# EAGLE design LEDBoard (EAGLE 7.6.0)
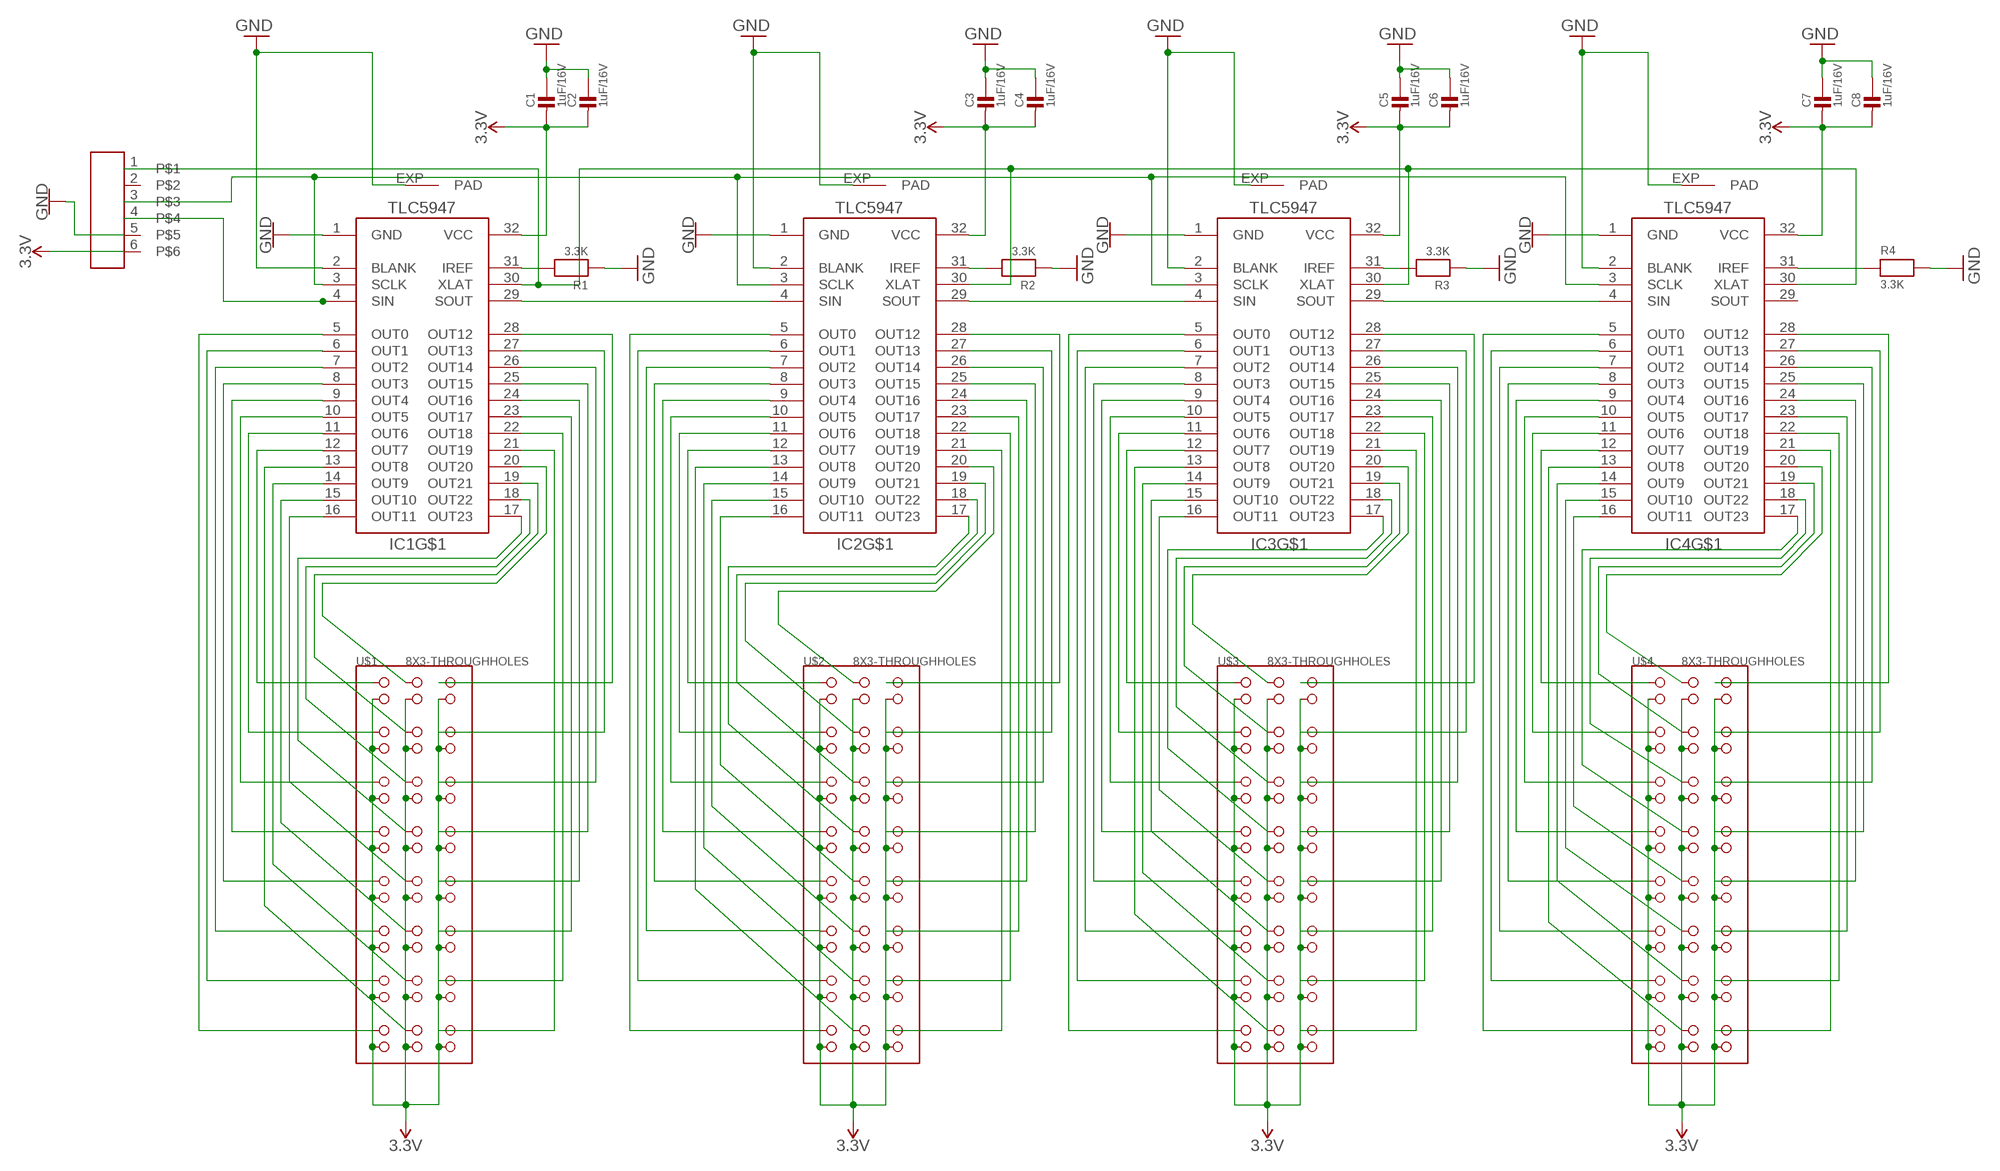
[diagram p0: schematic, sheet 1]

## Parts
C1  1uF/16V  CAP_CERAMIC_0805  [_0805]
C2  1uF/16V  CAP_CERAMIC_0805  [_0805]
C3  1uF/16V  CAP_CERAMIC_0805  [_0805]
C4  1uF/16V  CAP_CERAMIC_0805  [_0805]
C5  1uF/16V  CAP_CERAMIC_0805  [_0805]
C6  1uF/16V  CAP_CERAMIC_0805  [_0805]
C7  1uF/16V  CAP_CERAMIC_0805  [_0805]
C8  1uF/16V  CAP_CERAMIC_0805  [_0805]
IC1  TLC5947-DAP  [HTSSOP32DAP]
IC2  TLC5947-DAP  [HTSSOP32DAP]
IC3  TLC5947-DAP  [HTSSOP32DAP]
IC4  TLC5947-DAP  [HTSSOP32DAP]
R1  3.3K  RESISTOR_0805  [_0805]
R2  3.3K  RESISTOR_0805  [_0805]
R3  3.3K  RESISTOR_0805  [_0805]
R4  3.3K  RESISTOR_0805  [_0805]
U$1  8X3-THROUGHHOLES  [COLUMNOFTHROUGHHOLES]
U$2  8X3-THROUGHHOLES  [COLUMNOFTHROUGHHOLES]
U$3  8X3-THROUGHHOLES  [COLUMNOFTHROUGHHOLES]
U$4  8X3-THROUGHHOLES  [COLUMNOFTHROUGHHOLES]
U$5  CONNECTOR_6PIN  [CONNECTOR_6PIN]

## Nets
0: IC1.5(OUT0) U$1.0
1: IC1.6(OUT1) U$1.1
2: IC1.7(OUT2) U$1.2
3: IC1.8(OUT3) U$1.3
3.3V: C1.2 C2.2 C3.2 C4.2 C5.2 C6.2 C7.2 C8.2 IC1.32(VCC) IC2.32(VCC) IC3.32(VCC) IC4.32(VCC) U$1.V0(V) U$1.V1(V) U$1.V2(V) U$1.V3(V) U$1.V4(V) U$1.V5(V) U$1.V6(V) U$1.V7(V) U$1.V8(V) U$1.V9(V) U$1.V10(V) U$1.V11(V) U$1.V12(V) U$1.V13(V) U$1.V14(V) U$1.V15(V) U$1.V16(V) U$1.V17(V) U$1.V18(V) U$1.V19(V) U$1.V20(V) U$1.V21(V) U$1.V22(V) U$1.V23(V) U$2.V0(V) U$2.V1(V) U$2.V2(V) U$2.V3(V) U$2.V4(V) U$2.V5(V) U$2.V6(V) U$2.V7(V) U$2.V8(V) U$2.V9(V) U$2.V10(V) U$2.V11(V) U$2.V12(V) U$2.V13(V) U$2.V14(V) U$2.V15(V) U$2.V16(V) U$2.V17(V) U$2.V18(V) U$2.V19(V) U$2.V20(V) U$2.V21(V) U$2.V22(V) U$2.V23(V) U$3.V0(V) U$3.V1(V) U$3.V2(V) U$3.V3(V) U$3.V4(V) U$3.V5(V) U$3.V6(V) U$3.V7(V) U$3.V8(V) U$3.V9(V) U$3.V10(V) U$3.V11(V) U$3.V12(V) U$3.V13(V) U$3.V14(V) U$3.V15(V) U$3.V16(V) U$3.V17(V) U$3.V18(V) U$3.V19(V) U$3.V20(V) U$3.V21(V) U$3.V22(V) U$3.V23(V) U$4.V0(V) U$4.V1(V) U$4.V2(V) U$4.V3(V) U$4.V4(V) U$4.V5(V) U$4.V6(V) U$4.V7(V) U$4.V8(V) U$4.V9(V) U$4.V10(V) U$4.V11(V) U$4.V12(V) U$4.V13(V) U$4.V14(V) U$4.V15(V) U$4.V16(V) U$4.V17(V) U$4.V18(V) U$4.V19(V) U$4.V20(V) U$4.V21(V) U$4.V22(V) U$4.V23(V) U$5.6
4: IC1.9(OUT4) U$1.4
5: IC1.10(OUT5) U$1.5
6: IC1.11(OUT6) U$1.6
7: IC1.12(OUT7) U$1.7
8: IC1.13(OUT8) U$1.8
9: IC1.14(OUT9) U$1.9
10: IC1.15(OUT10) U$1.10
11: IC1.16(OUT11) U$1.11
12: IC1.17(OUT23) U$1.12
13: IC1.18(OUT22) U$1.13
14: IC1.19(OUT21) U$1.14
15: IC1.20(OUT20) U$1.15
16: IC1.21(OUT19) U$1.16
17: IC1.22(OUT18) U$1.17
18: IC1.23(OUT17) U$1.18
19: IC1.24(OUT16) U$1.19
20: IC1.25(OUT15) U$1.20
21: IC1.26(OUT14) U$1.21
22: IC1.27(OUT13) U$1.22
23: IC1.28(OUT12) U$1.23
24: IC2.5(OUT0) U$2.0
25: IC2.6(OUT1) U$2.1
26: IC2.7(OUT2) U$2.2
27: IC2.8(OUT3) U$2.3
28: IC2.9(OUT4) U$2.4
29: IC2.10(OUT5) U$2.5
30: IC2.11(OUT6) U$2.6
31: IC2.12(OUT7) U$2.7
32: IC2.13(OUT8) U$2.8
33: IC2.14(OUT9) U$2.9
34: IC2.15(OUT10) U$2.10
35: IC2.16(OUT11) U$2.11
36: IC2.17(OUT23) U$2.12
37: IC2.18(OUT22) U$2.13
38: IC2.19(OUT21) U$2.14
39: IC2.20(OUT20) U$2.15
40: IC2.21(OUT19) U$2.16
41: IC2.22(OUT18) U$2.17
42: IC2.23(OUT17) U$2.18
43: IC2.24(OUT16) U$2.19
44: IC2.25(OUT15) U$2.20
45: IC2.26(OUT14) U$2.21
46: IC2.27(OUT13) U$2.22
47: IC2.28(OUT12) U$2.23
48: IC3.5(OUT0) U$3.0
49: IC3.6(OUT1) U$3.1
50: IC3.7(OUT2) U$3.2
51: IC3.8(OUT3) U$3.3
52: IC3.9(OUT4) U$3.4
53: IC3.10(OUT5) U$3.5
54: IC3.11(OUT6) U$3.6
55: IC3.12(OUT7) U$3.7
56: IC3.13(OUT8) U$3.8
57: IC3.14(OUT9) U$3.9
58: IC3.15(OUT10) U$3.10
59: IC3.16(OUT11) U$3.11
60: IC3.17(OUT23) U$3.12
61: IC3.18(OUT22) U$3.13
62: IC3.19(OUT21) U$3.14
63: IC3.20(OUT20) U$3.15
64: IC3.21(OUT19) U$3.16
65: IC3.22(OUT18) U$3.17
66: IC3.23(OUT17) U$3.18
67: IC3.24(OUT16) U$3.19
68: IC3.25(OUT15) U$3.20
69: IC3.26(OUT14) U$3.21
70: IC3.27(OUT13) U$3.22
71: IC3.28(OUT12) U$3.23
72: IC4.5(OUT0) U$4.0
73: IC4.6(OUT1) U$4.1
74: IC4.7(OUT2) U$4.2
75: IC4.8(OUT3) U$4.3
76: IC4.9(OUT4) U$4.4
77: IC4.10(OUT5) U$4.5
78: IC4.11(OUT6) U$4.6
79: IC4.12(OUT7) U$4.7
80: IC4.13(OUT8) U$4.8
81: IC4.14(OUT9) U$4.9
82: IC4.15(OUT10) U$4.10
83: IC4.16(OUT11) U$4.11
84: IC4.17(OUT23) U$4.12
85: IC4.18(OUT22) U$4.13
86: IC4.19(OUT21) U$4.14
87: IC4.20(OUT20) U$4.15
88: IC4.21(OUT19) U$4.16
89: IC4.22(OUT18) U$4.17
90: IC4.23(OUT17) U$4.18
91: IC4.24(OUT16) U$4.19
92: IC4.25(OUT15) U$4.20
93: IC4.26(OUT14) U$4.21
94: IC4.27(OUT13) U$4.22
95: IC4.28(OUT12) U$4.23
CLK: IC1.3(SCLK) IC2.3(SCLK) IC3.3(SCLK) IC4.3(SCLK) U$5.3
DATA12: IC1.29(SOUT) IC2.4(SIN)
DATA23: IC2.29(SOUT) IC3.4(SIN)
DATA34: IC3.29(SOUT) IC4.4(SIN)
DATAIN: IC1.4(SIN) U$5.4
GND: C1.1 C2.1 C3.1 C4.1 C5.1 C6.1 C7.1 C8.1 IC1.1(GND) IC1.2(BLANK) IC1.EXP(PAD) IC2.1(GND) IC2.2(BLANK) IC2.EXP(PAD) IC3.1(GND) IC3.2(BLANK) IC3.EXP(PAD) IC4.1(GND) IC4.2(BLANK) IC4.EXP(PAD) R1.1 R2.1 R3.1 R4.2 U$5.5
IREF1: IC1.31(IREF) R1.2
IREF2: IC2.31(IREF) R2.2
IREF3: IC3.31(IREF) R3.2
IREF4: IC4.31(IREF) R4.1
XLAT: IC1.30(XLAT) IC2.30(XLAT) IC3.30(XLAT) IC4.30(XLAT) U$5.1
Unconnected: IC4.29(SOUT) U$5.2

## Library data of the parts
C1-C8 = Adafruit TLC5947:CAP_CERAMIC: Ceramic Capacitors For new designs, use the packages preceded by an '_' character since they are more reliable: The following footprints should be used on most boards: _0402 - Standard footprint for regular board layouts _0603 - Standard footprint for regular board layouts _0805 - Standard footprint for regular board layouts For extremely tight-pitch boards where space is at a premium, the following 'micro-pitch' footprints can be used (smaller pads, no silkscreen outline, etc.): _0402MP - Micro-pitch footprint for very dense/compact boards _0603MP - Micro-pitch footprint for very dense/compact boards _0805MP - Micro-pitch footprint for very dense/compact boards Commonly Stocked Parts 0402 - 0402 Surface Mount Capacitors 16pF 50V 5% [Digikey: 445-4899-2-ND] 18pF 50V 5% [Digikey: 490-1281-2-ND] 22pF 50V 5% [Digikey: 490-1283-2-ND] 68pF 50V 5% [Digikey: 490-1289-2-ND] 0.1uF 10V 10% [Digikey: 490-1318-2-ND] 1.0uF 6.3V 10% [Digikey: 490-1320-2-ND] 0603 - 0603 Surface Mount Capacitors 16 pF 50V 5% [Digikey: 445-5051-2-ND] 22 pF 50V [Digikey: PCC220ACVTR-ND] 33 pF 50V 5% [Digikey: 490-1415-1-ND] 56pF 50V 5% [Digikey: 490-1421-1-ND] 220pF 50V 5% [Digikey: 445-1285-1-ND] 680 pF 50V 2200 pF 50V 5% C0G [Digikey: 445-1297-1-ND] 5600 pF 100V 5% X7R [Digikey: 478-3711-1-ND] 0.1 µF 25V 10% [Digikey: PCC2277TR-ND] 0.22 µF 16V 10% X7R [Digikey: 445-1318-1-ND] 1.0 µF 25V 10% [Digikey: 445-5146-2-ND] 0603 - RF Specific 3pF 250V +/-0.1pF RF [Digikey: 712-1347-1-ND] 18 pF 250V 5% [Digikey: 478-3505-1-ND or 712-1322-1-ND] 56 pF 250V 5% C0G RF [Digikey: 490-4867-1-ND] 68 pF 250V RF [Digikey: 490-4868-1-ND] 0805 - 0805 Surface Mount Capacitors 220 pF 250V 2% RF Ceramic Capacitor [Digikey: 712-1398-1-ND] 1000 pF 50V 2% NP0 Ceramic Capacitor [Digikey: 478-3760-1-ND] 0.1 µF 25V 10% Ceramic Capacitor [Digikey: PCC1828TR-ND] 1.0 µF 16V 10% Ceramic Capacitor[Digikey: 490-1691-2-ND] 10.0 µF 10V 10% Ceramic Capacitor[Digikey: 709-1228-1-ND] 10.0 uF 16V 10% Ceramic Capacitor [Digikey: 478-5165-2-ND] 47 uF 6.3V 20% Ceramic Capacitor [Digikey: 587-1779-1-ND or 399-5506-1-ND] 1206 - 1206 Surface Mount Capacitors 47uF 10V 20% Ceramic Capacitor [Digikey: 490-5528-1-ND or 399-5508-1-ND or 445-6010-1-ND] 100uF 6.3V -20%, +80% Y5V Ceramic Capacitor (Digikey: 490-4512-1-ND, Mouser: 81-GRM31CF50J107ZE1L)
IC1-IC4 = Adafruit TLC5947:TLC5947
R1-R4 = Adafruit TLC5947:RESISTOR: Resistors For new designs, use the packages preceded by an '_' character since they are more reliable: The following footprints should be used on most boards: _0402 - Standard footprint for regular board layouts _0603 - Standard footprint for regular board layouts _0805 - Standard footprint for regular board layouts For extremely tight-pitch boards where space is at a premium, the following 'micro-pitch' footprints can be used (smaller pads, no silkscreen outline, etc.): _0402MP - Micro-pitch footprint for very dense/compact boards _0603MP - Micro-pitch footprint for very dense/compact boards _0805MP - Micro-pitch footprint for very dense/compact boards
U$1-U$4 = Adafruit TLC5947:8X3-THROUGHHOLES
U$5 = TIcustom:CONNECTOR_6PIN

## Board
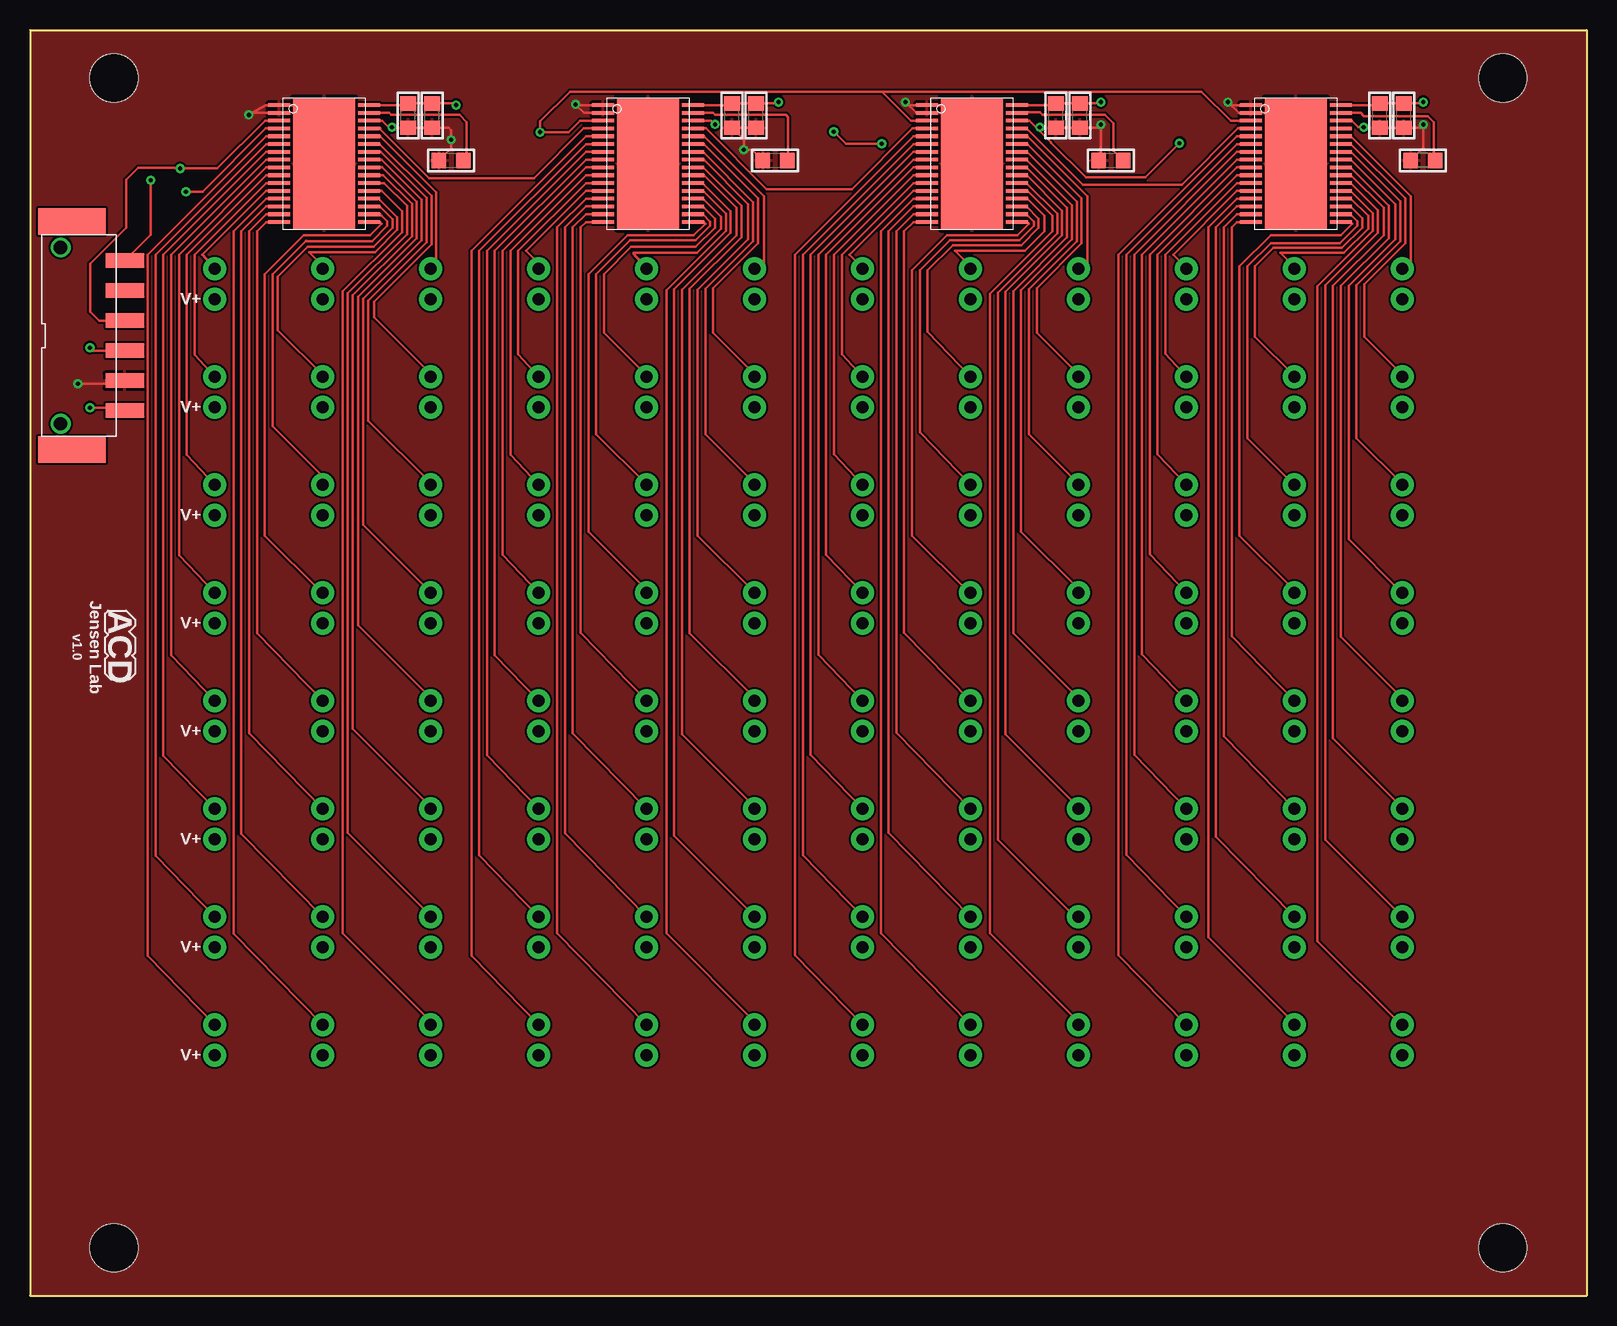
[diagram p1: board, top side]
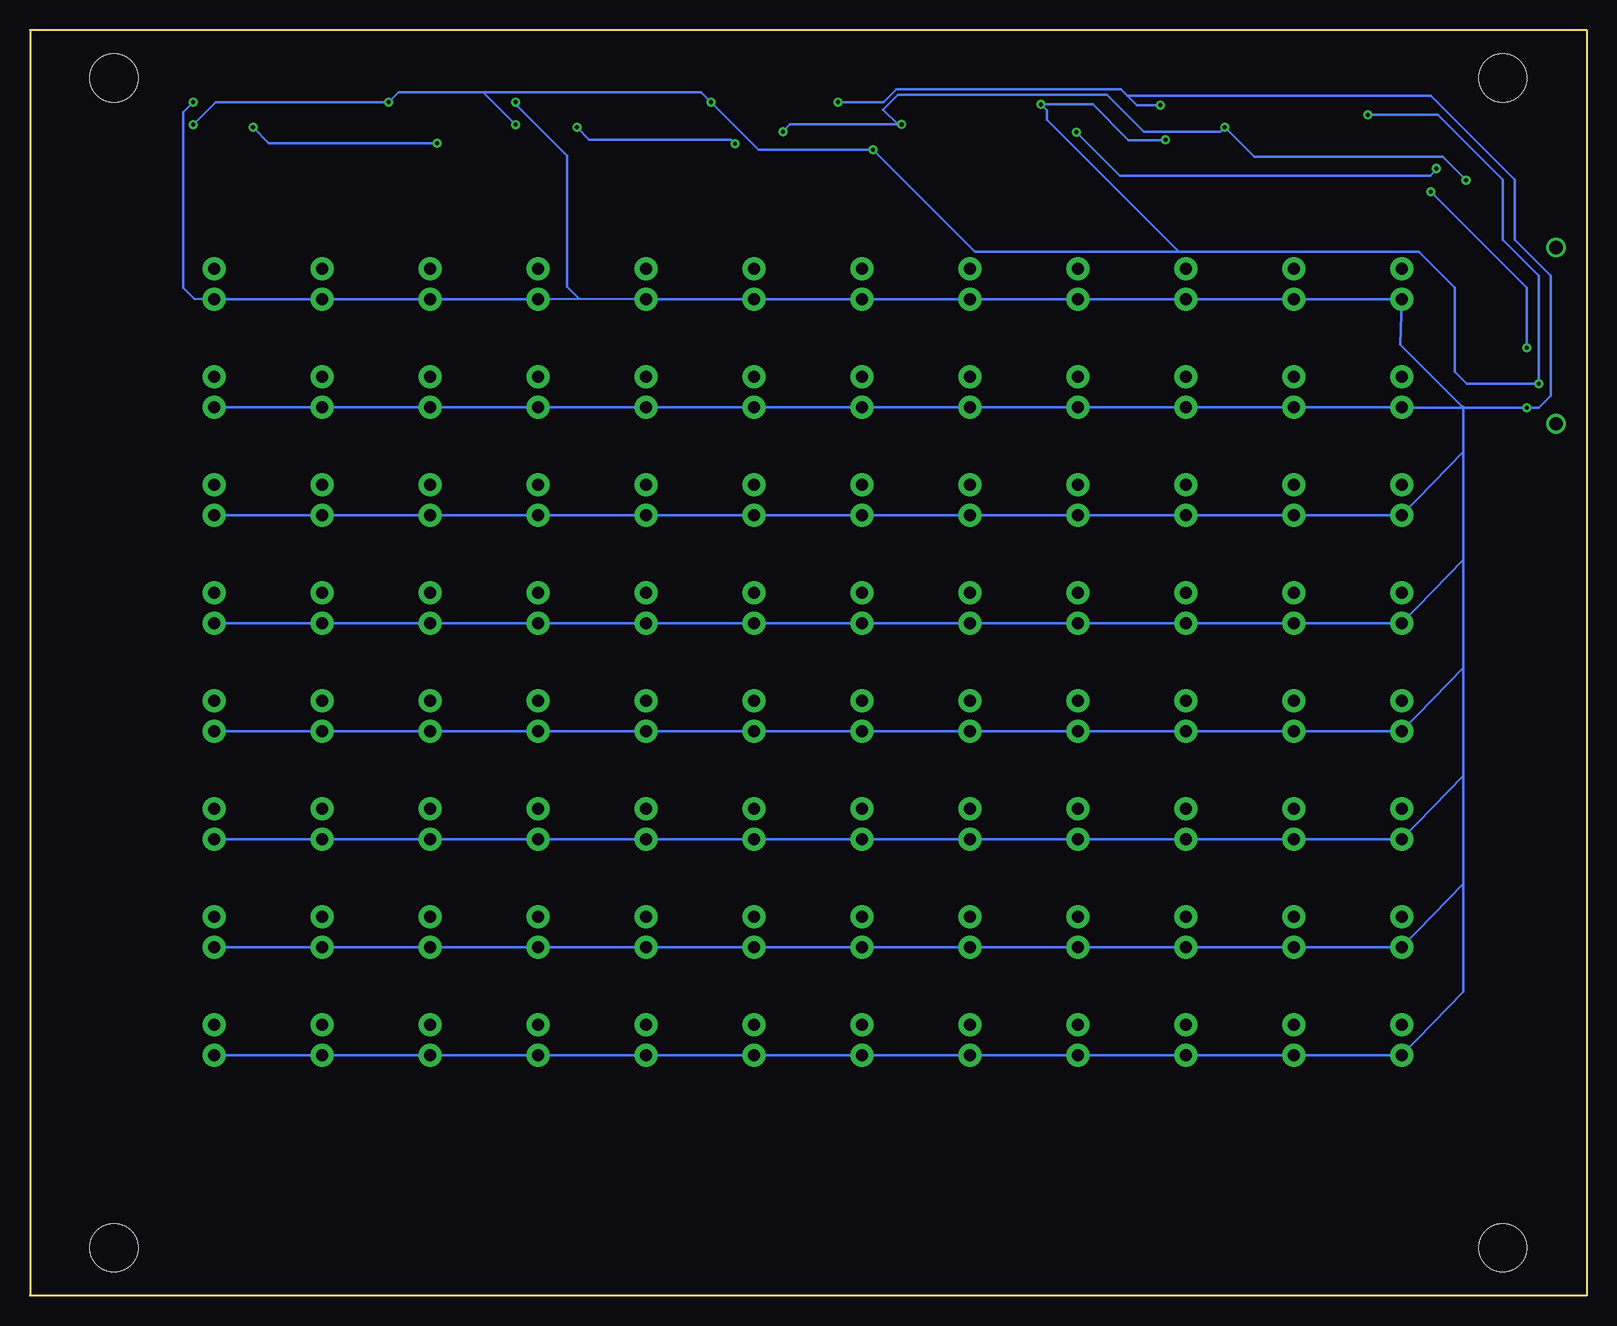
[diagram p2: board, bottom side, seen from below]

Size 129.76 x 105.47 mm. Coordinates in mm from the lower left corner, seen from the top.
Outline: 0,105.47 0,0 129.76,0 129.76,105.47 0,105.47
Copper layers (1*16): Top 0.035mm / dielectric 1.5mm / Bottom 0.035mm
Design rules "default *": minimum track width 6mil, minimum drill 0.35mm, track to track 7mil, track to pad 6mil, pad to pad 6mil, via to via 6mil, smd to smd 6mil, copper to edge 0mil, drill to drill 6mil, minimum pad ring 10mil, minimum via ring 8mil, stop-mask expansion 4mil, vias tented up to drill 0mil, thermal gap 10mil
Holes 4 mm at 7,4 122.76,4 7,101.47 122.76,101.47

### Footprints (pad centres in the part's own frame; a part is rotated, then mirrored left to right if it is on the bottom)
_0805 = smd 1.2 x 1.3: 1 -1.016,0; 2 1.016,0
HTSSOP32DAP = smd 0.3 x 1.8: 1 -4.875,-3.75; 2 -4.225,-3.75; 3 -3.575,-3.75; 4 -2.925,-3.75; 5 -2.275,-3.75; 6 -1.625,-3.75; 7 -0.975,-3.75; 8 -0.325,-3.75; 9 0.325,-3.75; 10 0.975,-3.75; 11 1.625,-3.75; 12 2.275,-3.75; 13 2.925,-3.75; 14 3.575,-3.75; 15 4.225,-3.75; 16 4.875,-3.75; 17 4.875,3.75; 18 4.225,3.75; 19 3.575,3.75; 20 2.925,3.75; 21 2.275,3.75; 22 1.625,3.75; 23 0.975,3.75; 24 0.325,3.75; 25 -0.325,3.75; 26 -0.975,3.75; 27 -1.625,3.75; 28 -2.275,3.75; 29 -2.925,3.75; 30 -3.575,3.75; 31 -4.225,3.75; 32 -4.875,3.75 | smd 11 x 5.2: EXP 0,0
COLUMNOFTHROUGHHOLES = drill 1 pad 1.905: 0 0,1.27; 1 0,10.27; 2 0,19.27; 3 0,28.27; 4 0,37.27; 5 0,46.27; 6 0,55.27; 7 0,64.27; 8 9,1.27; 9 9,10.27; 10 9,19.27; 11 9,28.27; 12 9,37.27; 13 9,46.27; 14 9,55.27; 15 9,64.27; 16 18,1.27; 17 18,10.27; 18 18,19.27; 19 18,28.27; 20 18,37.27; 21 18,46.27; 22 18,55.27; 23 18,64.27; V0 0,-1.27; V1 0,7.73; V2 0,16.73; V3 0,25.73; V4 0,34.73; V5 0,43.73; V6 0,52.73; V7 0,61.73; V8 9,-1.27; V9 9,7.73; V10 9,16.73; V11 9,25.73; V12 9,34.73; V13 9,43.73; V14 9,52.73; V15 9,61.73; V16 18,-1.27; V17 18,7.73; V18 18,16.73; V19 18,25.73; V20 18,34.73; V21 18,43.73; V22 18,52.73; V23 18,61.73
CONNECTOR_6PIN = smd 1.2 x 3.2: 1 -6.25,4.4; 2 -3.75,4.4; 3 -1.25,4.4; 4 1.25,4.4; 5 3.75,4.4; 6 6.25,4.4 | drill 1.1: 7 -7.35,-0.95; 8 7.35,-0.95 | smd 2.2 x 5.6: LMOUNT -9.5,0; RMOUNT 9.5,0

### Placement (x,y rotation side)
C1  114.52,98.34 90 top
C2  112.52,98.34 90 top
C3  87.52,98.34 90 top
C4  85.52,98.34 90 top
C5  60.52,98.34 90 top
C6  58.52,98.34 90 top
C7  33.52,98.34 90 top
C8  31.52,98.34 90 top
IC1  24.52,94.34 270 top
IC2  51.52,94.34 270 top
IC3  78.52,94.34 270 top
IC4  105.52,94.34 270 top
R1  35.1,94.6 0 top
R2  62.1,94.6 0 top
R3  90.1,94.6 0 top
R4  116.1,94.6 180 top
U$1  15.4,21.3 0 top
U$2  42.4,21.3 0 top
U$3  69.4,21.3 0 top
U$4  96.4,21.3 0 top
U$5  3.5,80 270 top

### Tracks (layer width: path | path; a pad name or v marks a point on that pad's centre or on a via)
0
  Top 0.203: IC1.5 19.7,96.61 9.82,86.74 9.82,77 9.82,28.31 U$1.0
1
  Top 0.203: IC1.6 19.7,95.97 10.47,86.74 10.47,36.66 U$1.1
2
  Top 0.203: IC1.7 19.7,95.31 11.12,86.74 11.12,45.01 U$1.2
3
  Top 0.203: IC1.8 19.7,94.67 11.77,86.74 11.77,53.36 U$1.3
3.3V  (via drill 0.35)
  Top 0.203: IC1.32 31.52,99.22 C8.2 C7.2 35.38,99.36 v35.52,99.22 | IC2.32 58.38,99.22 C6.2 C5.2 62.29,99.36 v62.4,99.47 | IC3.32 85.38,99.22 C4.2 C3.2 89.16,99.36 v89.27,99.47 | IC4.32 112.38,99.22 C2.2 C1.2 116.04,99.36 v116.14,99.47 | v5,74 7.65,74 U$5.6
  Bottom 0.203: 84,83.07 U$3.V15 U$3.V7 U$2.V23 U$2.V15 U$2.V7 U$1.V23 U$1.V15 U$1.V7 15.52,79.24 10.28,74 | 84,83.07 U$3.V23 U$4.V7 U$4.V15 U$4.V23 116.07,83.07 117,84 117,98.61 v116.14,99.47 | U$4.V22 U$4.V14 U$4.V6 U$3.V22 U$3.V14 U$3.V6 U$2.V22 U$2.V14 U$2.V6 U$1.V22 U$1.V14 U$1.V6 15.45,74 10.28,74 | U$4.V21 U$4.V13 U$4.V5 U$3.V21 U$3.V13 U$3.V5 U$2.V21 U$2.V13 U$2.V5 U$1.V21 U$1.V13 U$1.V5 10.28,70.31 | U$4.V20 U$4.V12 U$4.V4 U$3.V20 U$3.V12 U$3.V4 U$2.V20 U$2.V12 U$2.V4 U$1.V20 U$1.V12 U$1.V4 10.28,61.31 | U$4.V19 U$4.V11 U$4.V3 U$3.V19 U$3.V11 U$3.V3 U$2.V19 U$2.V11 U$2.V3 U$1.V19 U$1.V11 U$1.V3 10.28,52.31 | U$4.V18 U$4.V10 U$4.V2 U$3.V18 U$3.V10 U$3.V2 U$2.V18 U$2.V10 U$2.V2 U$1.V18 U$1.V10 U$1.V2 10.28,43.31 | U$4.V17 U$4.V9 U$4.V1 U$3.V17 U$3.V9 U$3.V1 U$2.V17 U$2.V9 U$2.V1 U$1.V17 U$1.V9 U$1.V1 10.28,34.31 | U$4.V16 U$4.V8 U$4.V0 U$3.V16 U$3.V8 U$3.V0 U$2.V16 U$2.V8 U$2.V0 U$1.V16 U$1.V8 U$1.V0 10.28,25.31 10.28,34.31 | 10.28,52.31 10.28,43.31 | 10.28,61.31 10.28,52.31 | 10.28,70.31 10.28,61.31 | 10.28,70.31 10.28,74 | 10.28,74 10.28,74.07 | 10.28,34.31 10.28,43.31 | v89.27,99.47 89.27,99.27 85,95 85,84.07 84,83.07 | 38.26,100 38.81,100.55 57.55,100.55 58.63,99.47 v62.4,99.47 | 38.26,100 37.48,99.22 v35.52,99.22 | 38.26,100 13,100 6,93 6,88 3,85 3,75 4,74 v5,74 10.28,74
4
  Top 0.203: IC1.9 19.7,94.02 12.42,86.74 12.42,61.71 U$1.4
5
  Top 0.203: IC1.10 19.7,93.36 13.07,86.74 13.07,70.06 U$1.5
6
  Top 0.203: IC1.11 19.7,92.72 13.72,86.74 13.72,78.41 U$1.6
7
  Top 0.203: IC1.12 19.7,92.06 14.37,86.74 14.39,86.74 U$1.7
8
  Top 0.203: IC1.13 19.7,91.42 16.97,88.69 16.97,30.16 U$1.8
9
  Top 0.203: IC1.14 19.7,90.77 17.62,88.69 17.62,38.51 U$1.9
10
  Top 0.203: IC1.15 19.7,90.11 18.27,88.69 18.27,46.86 U$1.10
11
  Top 0.203: IC1.16 19.7,89.47 18.92,88.69 18.92,55.21 U$1.11
12
  Top 0.203: U$1.12 24.3,58.61 19.57,63.34 19.57,85.11 22.82,88.36 28.34,88.36 29.32,89.34 29.2,89.47 IC1.17
13
  Top 0.203: U$1.13 24.52,68.14 20.22,72.44 20.22,85.11 22.98,87.88 | 22.98,87.88 23.01,87.91 | 29.32,89.99 | 29.32,89.99 29.78,89.53 29.78,89.15 28.5,87.88 22.98,87.88 | IC1.18 29.19,90.11 29.32,89.99
14
  Top 0.203: U$1.14 24.5,76.61 20.65,80.46 20.65,84.9 23.14,87.39 28.63,87.39 30.21,88.97 30.21,89.71 29.16,90.77 IC1.19
15
  Top 0.203: U$1.15 24.52,85.69 23.27,86.94 28.75,86.94 30.61,88.8 30.61,89.88 29.08,91.42 IC1.20
16
  Top 0.203: U$1.16 33.52,22.74 26.07,30.19 26.07,83.68 31.02,88.64 31.02,90.35 29.3,92.06 IC1.21
17
  Top 0.203: U$1.17 33.42,31.61 26.48,38.56 26.48,83.52 31.43,88.47 31.43,90.81 29.52,92.72 IC1.22
18
  Top 0.203: U$1.18 33.52,40.62 26.88,47.25 26.88,83.35 31.84,88.3 31.84,90.97 29.45,93.36 IC1.23
19
  Top 0.203: U$1.19 33.52,49.72 27.37,55.87 27.37,83.26 32.24,88.13 32.24,91.14 29.37,94.02 IC1.24
20
  Top 0.203: U$1.20 33.4,58.61 27.78,64.23 27.78,83.09 32.65,87.96 32.65,91.31 29.29,94.67 IC1.25
21
  Top 0.203: U$1.21 33.5,67.61 28.18,72.93 28.18,82.92 33.05,87.79 33.05,91.48 29.22,95.31 IC1.26
22
  Top 0.203: U$1.22 33.52,76.69 28.67,81.54 28.67,82.83 33.46,87.62 33.46,91.65 29.14,95.97 IC1.27
23
  Top 0.203: U$1.23 33.72,85.61 33.87,85.77 33.87,91.94 29.2,96.61 IC1.28
24
  Top 0.203: IC2.5 46.34,96.61 36.8,87.06 36.8,28.34 U$2.0
25
  Top 0.203: IC2.6 46.34,95.97 37.45,87.06 37.45,36.69 U$2.1
26
  Top 0.203: IC2.7 46.34,95.31 38.09,87.06 38.09,45.03 U$2.2
27
  Top 0.203: IC2.8 46.34,94.67 38.74,87.06 38.74,53.38 U$2.3
28
  Top 0.203: IC2.9 46.34,94.02 39.4,87.06 39.4,61.73 U$2.4
29
  Top 0.203: IC2.10 46.34,93.36 40.05,87.06 40.05,70.08 U$2.5
30
  Top 0.203: IC2.11 46.34,92.72 40.7,87.06 40.7,78.44 U$2.6
31
  Top 0.203: IC2.12 46.34,92.06 41.34,87.06 42.52,85.89 U$2.7
32
  Top 0.203: IC2.13 46.34,91.42 43.95,89.02 43.95,30.18 U$2.8
33
  Top 0.203: IC2.14 46.34,90.77 44.59,89.02 44.59,38.53 U$2.9
34
  Top 0.203: IC2.15 46.34,90.11 45.24,89.02 45.24,46.88 U$2.10
35
  Top 0.203: IC2.16 46.34,89.47 45.9,89.02 45.9,55.23 U$2.11
36
  Top 0.203: U$2.12 51.52,58.69 46.55,63.66 46.55,85.11 49.8,88.36 55.32,88.36 56.3,89.34 56.17,89.47 IC2.17
37
  Top 0.203: U$2.13 51.38,67.61 47.2,71.79 47.2,85.11 50.04,87.96 55.49,87.96 56.7,89.17 56.7,89.51 56.09,90.11 IC2.18
38
  Top 0.203: U$2.14 51.48,76.61 47.84,80.24 47.84,85.11 50.12,87.39 55.49,87.39 57.11,89 57.11,89.72 56.06,90.77 IC2.19
39
  Top 0.203: IC2.20 56.09,91.42 57.6,89.9 57.6,88.9 55.6,86.9 50.3,86.9 50.3,86.83 U$2.15
40
  Top 0.203: U$2.16 60.52,22.71 53.05,30.19 53.05,83.79 58,88.75 58,90.16 56.09,92.06 IC2.21
41
  Top 0.203: U$2.17 60.4,31.61 53.7,38.31 53.7,83.87 58.41,88.58 58.41,90.37 56.06,92.72 IC2.22
42
  Top 0.203: U$2.18 60.5,40.61 54.34,46.77 54.34,83.81 58.9,88.36 58.9,90.64 56.17,93.36 IC2.23
43
  Top 0.203: U$2.19 60.52,49.69 54.99,55.22 54.99,83.89 59.3,88.2 59.3,90.81 56.09,94.02 IC2.24
44
  Top 0.203: U$2.20 60.38,58.61 55.65,63.34 55.65,83.81 59.87,88.04 59.87,90.97 56.17,94.67 IC2.25
45
  Top 0.203: U$2.21 60.48,67.61 56.3,71.79 56.3,83.89 60.28,87.87 60.28,91.13 56.09,95.31 IC2.26
46
  Top 0.203: U$2.22 60.52,76.67 56.95,80.24 56.95,83.97 60.68,87.7 60.68,91.45 56.17,95.97 IC2.27
47
  Top 0.203: U$2.23 60.69,85.61 61.17,86.09 61.17,91.61 56.17,96.61 IC2.28
48
  Top 0.203: IC3.5 73.64,96.61 63.77,86.74 63.77,28.36 U$3.0
49
  Top 0.203: IC3.6 73.64,95.97 64.42,86.74 64.42,36.71 U$3.1
50
  Top 0.203: IC3.7 73.64,95.31 65.07,86.74 65.07,45.06 U$3.2
51
  Top 0.203: IC3.8 73.64,94.67 65.72,86.74 65.72,53.41 U$3.3
52
  Top 0.203: IC3.9 73.64,94.02 66.37,86.74 66.37,61.76 U$3.4
53
  Top 0.203: IC3.10 73.64,93.36 67.02,86.74 67.02,70.11 U$3.5
54
  Top 0.203: IC3.11 73.64,92.72 67.67,86.74 67.67,78.46 U$3.6
55
  Top 0.203: IC3.12 73.64,92.06 68.32,86.74 69.45,85.61 U$3.7
56
  Top 0.203: IC3.13 73.64,91.42 70.92,88.69 70.92,30.21 U$3.8
57
  Top 0.203: IC3.14 73.64,90.77 71.57,88.69 71.57,38.56 U$3.9
58
  Top 0.203: IC3.15 73.64,90.11 72.22,88.69 72.22,46.91 U$3.10
59
  Top 0.203: IC3.16 73.64,89.47 72.87,88.69 72.87,55.26 U$3.11
60
  Top 0.203: U$3.12 78.25,58.61 73.52,63.34 73.52,85.44 76.44,88.36 82.3,88.36 83.27,89.34 83.14,89.47 IC3.17
61
  Top 0.203: IC3.18 83.07,90.11 83.68,89.51 83.68,89.17 82.46,87.96 76.69,87.96 74.17,85.44 74.17,71.96 U$3.13
62
  Top 0.203: IC3.19 83.06,90.77 84.08,89.75 84.08,89 82.63,87.55 76.93,87.55 74.82,85.44 74.82,80.31 U$3.14
63
  Top 0.203: U$3.15 78.52,85.64 77.09,87.06 82.94,87.06 84.57,88.69 84.57,89.99 83.14,91.42 IC3.20
64
  Top 0.203: U$3.16 87.52,22.69 80.02,30.19 80.02,83.49 85.22,88.69 85.22,89.99 83.14,92.06 IC3.21
65
  Top 0.203: U$3.17 87.05,31.61 80.67,37.99 80.67,83.56 85.63,88.52 85.63,90.16 83.07,92.72 IC3.22
66
  Top 0.203: U$3.18 87.47,40.61 81.32,46.77 81.32,83.64 86.03,88.35 86.03,90.43 83.09,93.36 IC3.23
67
  Top 0.203: U$3.19 87.52,49.66 81.97,55.22 81.97,83.72 86.44,88.19 86.44,90.64 83.06,94.02 IC3.24
68
  Top 0.203: U$3.20 87.52,58.77 82.62,63.66 82.62,83.79 86.85,88.02 86.85,90.89 83.06,94.67 IC3.25
69
  Top 0.203: U$3.21 87.45,67.61 83.27,71.79 83.27,83.87 87.25,87.85 87.25,91.15 83.09,95.31 IC3.26
70
  Top 0.203: U$3.22 87.52,76.64 83.92,80.24 83.92,83.94 87.66,87.68 87.66,91.45 83.14,95.97 IC3.27
71
  Top 0.203: U$3.23 87.99,85.61 88.14,85.77 88.14,91.61 83.14,96.61 IC3.28
72
  Top 0.203: IC4.5 100.62,96.61 90.75,86.74 90.75,28.39 U$4.0
73
  Top 0.203: IC4.6 100.62,95.97 91.39,86.74 91.39,36.73 U$4.1
74
  Top 0.203: IC4.7 100.62,95.31 92.05,86.74 92.05,45.09 U$4.2
75
  Top 0.203: IC4.8 100.62,94.67 92.69,86.74 92.69,53.44 U$4.3
76
  Top 0.203: IC4.9 100.62,94.02 93.34,86.74 93.34,61.78 U$4.4
77
  Top 0.203: IC4.10 100.62,93.36 94,86.74 94,70.14 U$4.5
78
  Top 0.203: IC4.11 100.62,92.72 94.64,86.74 94.64,78.48 U$4.6
79
  Top 0.203: IC4.12 100.62,92.06 95.3,86.74 96.42,85.61 U$4.7
80
  Top 0.203: U$4.8 105.47,22.61 98.22,29.86 98.22,89.02 100.62,91.42 IC4.13
81
  Top 0.203: IC4.14 100.62,90.77 98.87,89.02 98.87,38.26 U$4.9
82
  Top 0.203: IC4.15 100.62,90.11 99.52,89.02 99.52,46.61 U$4.10
83
  Top 0.203: IC4.16 100.62,89.47 100.17,89.02 100.17,54.96 U$4.11
84
  Top 0.203: U$4.12 105.52,58.64 100.82,63.34 100.82,85.77 103.42,88.36 109.27,88.36 110.25,89.34 110.12,89.47 IC4.17
85
  Top 0.203: U$4.13 105.33,67.61 101.47,71.47 101.47,85.77 103.42,87.72 109.19,87.72 110.65,89.17 110.65,89.53 110.06,90.11 IC4.18
86
  Top 0.203: U$4.14 105.42,76.61 102.12,79.92 102.12,85.77 103.66,87.31 109.36,87.31 111.06,89 111.06,89.77 110.06,90.77 IC4.19
87
  Top 0.203: U$4.15 105.52,85.61 104.23,86.9 109.53,86.9 111.55,88.92 111.55,89.99 110.12,91.42 IC4.20
88
  Top 0.203: U$4.16 114.25,22.61 107.32,29.54 107.32,84.12 111.95,88.75 111.95,90.18 110.06,92.06 IC4.21
89
  Top 0.203: U$4.17 114.35,31.61 107.97,37.99 107.97,84.19 112.36,88.58 112.36,90.45 110.09,92.72 IC4.22
90
  Top 0.203: U$4.18 114.45,40.61 108.62,46.44 108.62,84.14 112.84,88.36 112.84,90.64 110.12,93.36 IC4.23
91
  Top 0.203: U$4.19 114.52,49.64 109.27,54.89 109.27,84.14 113.25,88.12 113.25,90.83 110.06,94.02 IC4.24
92
  Top 0.203: U$4.20 114.33,58.61 109.92,63.02 109.92,84.14 113.82,88.04 113.82,90.97 110.12,94.67 IC4.25
93
  Top 0.203: U$4.21 114.42,67.61 110.57,71.47 110.57,84.22 114.23,87.87 114.23,91.21 110.12,95.31 IC4.26
94
  Top 0.203: U$4.22 114.52,76.61 111.22,79.92 111.22,84.29 114.63,87.7 114.63,91.45 110.12,95.97 IC4.27
95
  Top 0.203: U$4.23 114.64,85.61 115.12,86.09 115.12,91.61 110.12,96.61 IC4.28
CLK  (via drill 0.35)
  Top 0.203: IC1.3 19.59,97.92 15.61,93.93 v12.52,93.93 12.45,94 9,94 8,93 8,89 5,86 5,82 5.75,81.25 U$5.3 | IC2.3 45.84,97.92 44.9,96.97 v42.52,96.97 42.52,97.86 45,100.34 71,100.34 | IC3.3 73.42,97.92 71,100.34 | 71,100.34 97.66,100.34 100.08,97.92 IC4.3
  Bottom 0.203: v12.52,93.93 12.52,93.84 13.02,93.34 38.9,93.34 v42.52,96.97
DATA12
  Top 0.203: IC1.29 29.12,97.27 33.28,93.1 42,93.1 46.16,97.27 IC2.4
  Top 0.254: 29.2,97.27 IC1.29
DATA23
  Top 0.203: IC2.29 56.34,97.27 61.4,92.2 68.5,92.2 73.56,97.27 IC3.4
  Top 0.254: 56.09,97.27 IC2.29
DATA34
  Top 0.203: IC3.29 83.07,97.27 87.76,92.58 96.01,92.58 100.69,97.27 IC4.4
DATAIN  (via drill 0.35)
  Top 0.203: v13,92 14.4,92 19.66,97.27 IC1.4 | v5,79 5.25,78.75 U$5.4
  Bottom 0.203: v5,79 5,84 v13,92
GND  (via drill 0.35)
  Top 0.203: 45.54,99.22 IC2.1 50.78,99.22 51.52,98.48 IC2.EXP | 45.54,99.22 v45.49,99.27 | IC2.2 46.19,98.56 45.54,99.22 | 73.23,99.22 IC3.1 77.78,99.22 78,99 78,94.86 IC3.EXP 78.11,94.34 78.06,94.39 | IC3.2 73.89,98.56 v72.98,99.47 | 100.11,99.22 IC4.1 104.78,99.22 105,99 105,94.86 IC4.EXP | IC4.2 100.76,98.56 v99.86,99.47 | C8.1 C7.1 34.88,97.32 35.1,97.1 v35.1,96.32 35.1,95.62 R1.1 | C4.1 C3.1 89,97.32 v89.27,97.59 89.27,94.79 R3.1 | C2.1 C1.1 115.88,97.32 v116.14,97.59 116.14,95.66 R4.2 | IC1.2 18.42,98.56 v18.25,98.39 19.64,99.22 IC1.1 23.79,99.22 24,99 24,94.86 IC1.EXP | C5.1 C6.1 59.5,96.34 v59.5,95.5 60.18,95.5 R2.1 | v4,76 7.65,76 U$5.5
  Top 0.254: 20.07,98.56 IC1.2 | v72.98,99.47 73.23,99.22 | v99.86,99.47 100.11,99.22
  Bottom 0.203: v116.14,97.59 114.27,99.47 v99.86,99.47 99.03,100.3 92,100.3 | 92,100.3 73.82,100.3 v72.98,99.47 69.02,95.5 v59.5,95.5 51,87 34,87 | v89.27,97.59 89.29,97.59 92,100.3 | 34,87 14,87 11,84 11,77 10,76 v4,76 4,85 7,88 7,93 12.39,98.39 v18.25,98.39 | 34,87 45,98 45,98.78 v45.49,99.27 41.16,99.27 38.2,96.3 35.12,96.3 v35.1,96.32
  pour Top: 0,0 129.76,0 129.76,105.47 0,105.47
IREF1
  Top 0.203: IC1.31 29.93,98.56 30.1,98.4 35.8,98.4 36.4,97.8 36.4,94.88 R1.2
IREF2
  Top 0.203: IC2.31 56.94,98.56 57.1,98.4 63,98.4 63.2,98.2 63.2,94.68 R2.2
IREF3
  Top 0.203: IC3.31 82.31,98.6 84.2,98.6 84.4,98.4 89.6,98.4 90.3,97.7 90.3,95.42 R3.2
IREF4
  Top 0.203: IC4.31 110.94,98.56 111.2,98.3 116.5,98.3 117,97.8 117,94.72 R4.1
XLAT  (via drill 0.35)
  Top 0.203: IC1.30 29.34,97.92 29.89,97.36 v30.17,97.36 | IC2.30 56.78,97.92 v57.1,97.6 | IC3.30 83.32,97.92 83.87,97.36 v84.17,97.36 84.17,97.03 84.75,96.44 84.79,96.44 85.12,96.12 85.12,96.08 88,93.2 92.98,93.2 v95.82,96.04 | IC4.30 110.19,97.92 110.75,97.36 v111.17,97.36 | v67,97 68,96 v71,96 | U$5.1 10.05,88.4 v10.05,92.95
  Bottom 0.203: v84.17,97.36 83.14,96.34 71.34,96.34 v71,96 | v95.82,96.04 109.84,96.04 v111.17,97.36 | 57.41,97.6 58.65,98.84 57.4,100.09 40,100.09 36.91,97 30.54,97 v30.17,97.36 27.7,94.9 12,94.9 v10.05,92.95 | v57.1,97.6 66.4,97.6 v67,97
  Bottom 0.254: 57.41,97.6 v57.1,97.6

### Text on the board
tPlace: V+ | V+ | V+ | V+ | v1.0 | Jensen Lab | ACD | V+ | V+ | V+ | V+